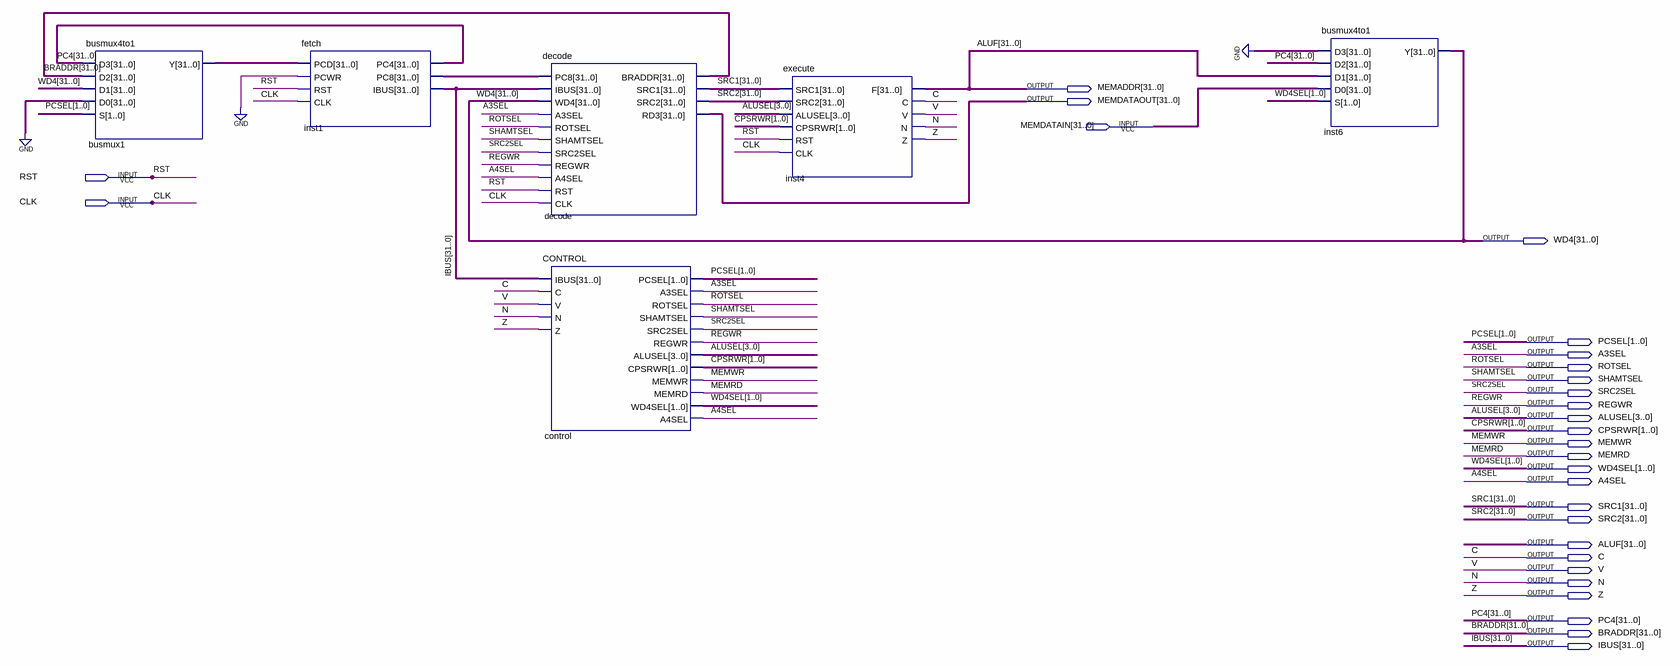
[diagram p0: schematic sheet]
// Quartus schematic scp.bdf as structural Verilog: 6 symbols, 28 pins
module scp (
  input  [31:0] MEMDATAIN,
  input  RST,
  input  CLK,
  output [31:0] MEMADDR,
  output [31:0] MEMDATAOUT,
  output [31:0] WD4,
  output [1:0] PCSEL,
  output A3SEL,
  output ROTSEL,
  output SHAMTSEL,
  output SRC2SEL,
  output REGWR,
  output [3:0] ALUSEL,
  output [1:0] CPSRWR,
  output MEMWR,
  output MEMRD,
  output [1:0] WD4SEL,
  output A4SEL,
  output [31:0] SRC1,
  output [31:0] SRC2,
  output [31:0] ALUF,
  output C,
  output V,
  output N,
  output Z,
  output [31:0] PC4,
  output [31:0] BRADDR,
  output [31:0] IBUS
);

  wire [31:0] busmux1_y, inst1_pc8;

  busmux4to1 busmux1 (.D3(PC4), .D2(BRADDR), .D1(WD4), .D0({32{1'b0}}), .S(PCSEL), .Y(busmux1_y));
  fetch inst1 (.PCD(busmux1_y), .PCWR(1'b0), .RST(RST), .CLK(CLK), .PC4(PC4), .PC8(inst1_pc8), .IBUS(IBUS));
  decode decode (
    .PC8(inst1_pc8), .IBUS(IBUS), .WD4(WD4), .A3SEL(A3SEL), .ROTSEL(ROTSEL), .SHAMTSEL(SHAMTSEL),
    .SRC2SEL(SRC2SEL), .REGWR(REGWR), .A4SEL(A4SEL), .RST(RST), .CLK(CLK), .BRADDR(BRADDR), .SRC1(SRC1),
    .SRC2(SRC2), .RD3(MEMDATAOUT));
  CONTROL control (
    .IBUS(IBUS), .C(C), .V(V), .N(N), .Z(Z), .PCSEL(PCSEL), .A3SEL(A3SEL), .ROTSEL(ROTSEL),
    .SHAMTSEL(SHAMTSEL), .SRC2SEL(SRC2SEL), .REGWR(REGWR), .ALUSEL(ALUSEL), .CPSRWR(CPSRWR), .MEMWR(MEMWR),
    .MEMRD(MEMRD), .WD4SEL(WD4SEL), .A4SEL(A4SEL));
  execute inst4 (
    .SRC1(SRC1), .SRC2(SRC2), .ALUSEL(ALUSEL), .CPSRWR(CPSRWR), .RST(RST), .CLK(CLK), .F(ALUF), .C(C), .V(V),
    .N(N), .Z(Z));
  busmux4to1 inst6 (.D3({32{1'b0}}), .D2(PC4), .D1(ALUF), .D0(MEMDATAIN), .S(WD4SEL), .Y(WD4));

  assign MEMADDR = ALUF;
endmodule
